# EasyEDA schematic SCH_esphome-ajax_2022-05-22.json
TITLE: Sheet_1; REV: 1.0; Date: 2019-04-17; Sheet: 1/1; Drawn By: UserSupport; Company: Your Company
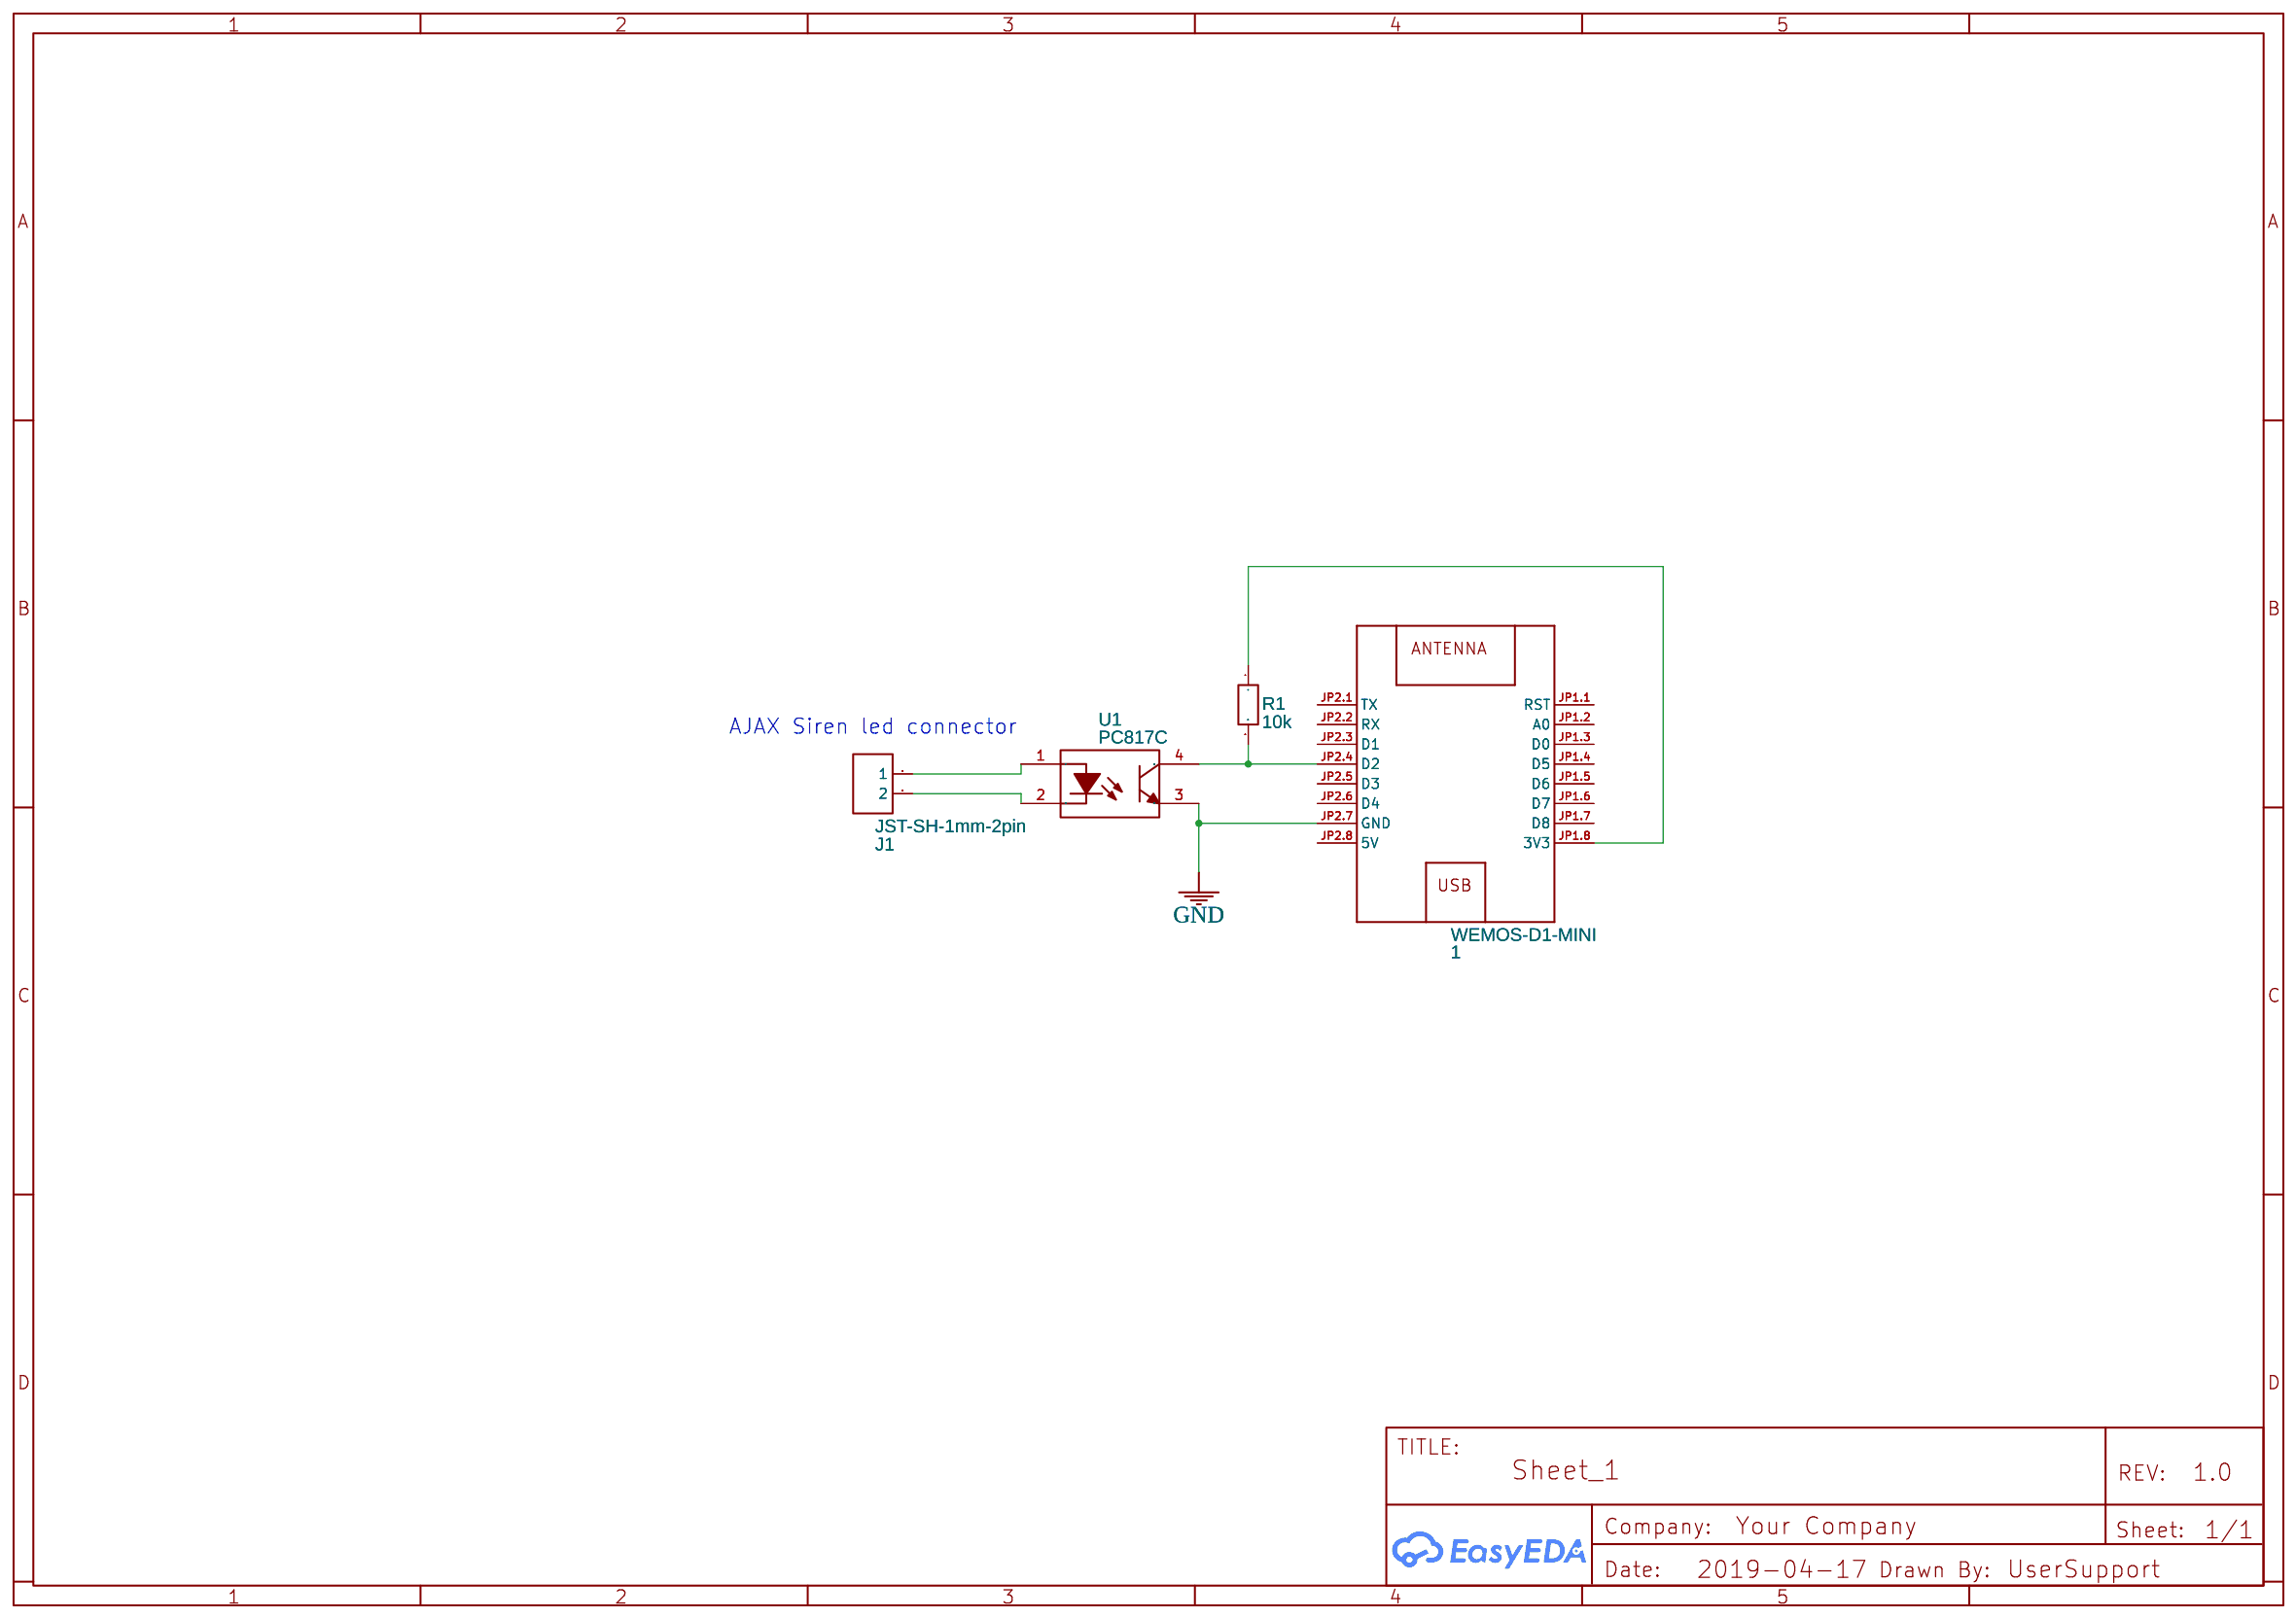
[diagram p0: schematic sheet]

## Parts
1  WEMOS-D1-MINI  [WEMOS-D1-MINI]
J1  JST-SH-1mm-2pin  [JST-SH-1.0-2PIN-VERT]
R1  10k  [R_AXIAL-0.4]
U1  PC817C  [DIP-4]

## Library data of the parts
1 = WEMOS-D1-MINI: Contributor: Krzysztof
J1 = jst-sh-2p-ver: Supplier Part: C124375; Supplier: LCSC; Contributor: Do Hung
R1 = R_AXIAL-0.4_EU: Contributor: LCEDA_Lib
U1 = -: Supplier: LCSC; Supplier Part: C115500; Manufacturer: Wuxi China Resources Huajing Microelectronics; Contributor: LCSC

## Nets
GND: 1.JP2.7(GND) U1.3(EM)
Net-(1-JP1.8): 1.JP1.8(3V3) R1.1
Net-(1-JP2.4): 1.JP2.4(D2) R1.2 U1.4(COL)
Net-(J1-1): J1.1 U1.1(AN)
Net-(J1-2): J1.2 U1.2(CAT)

Not connected (* = marked no-connect by the designer): 1 JP1.1(RST) JP1.2(A0) JP1.3(D0) JP1.4(D5) JP1.5(D6) JP1.6(D7) JP1.7(D8) JP2.1(TX) JP2.2(RX) JP2.3(D1) JP2.5(D3) JP2.6(D4) JP2.8(5V)

## Notes on the sheet
- AJAX Siren led connector
